# EAGLE design MCPGrundplatte_16_Ausgabe (EAGLE 9.6.2)
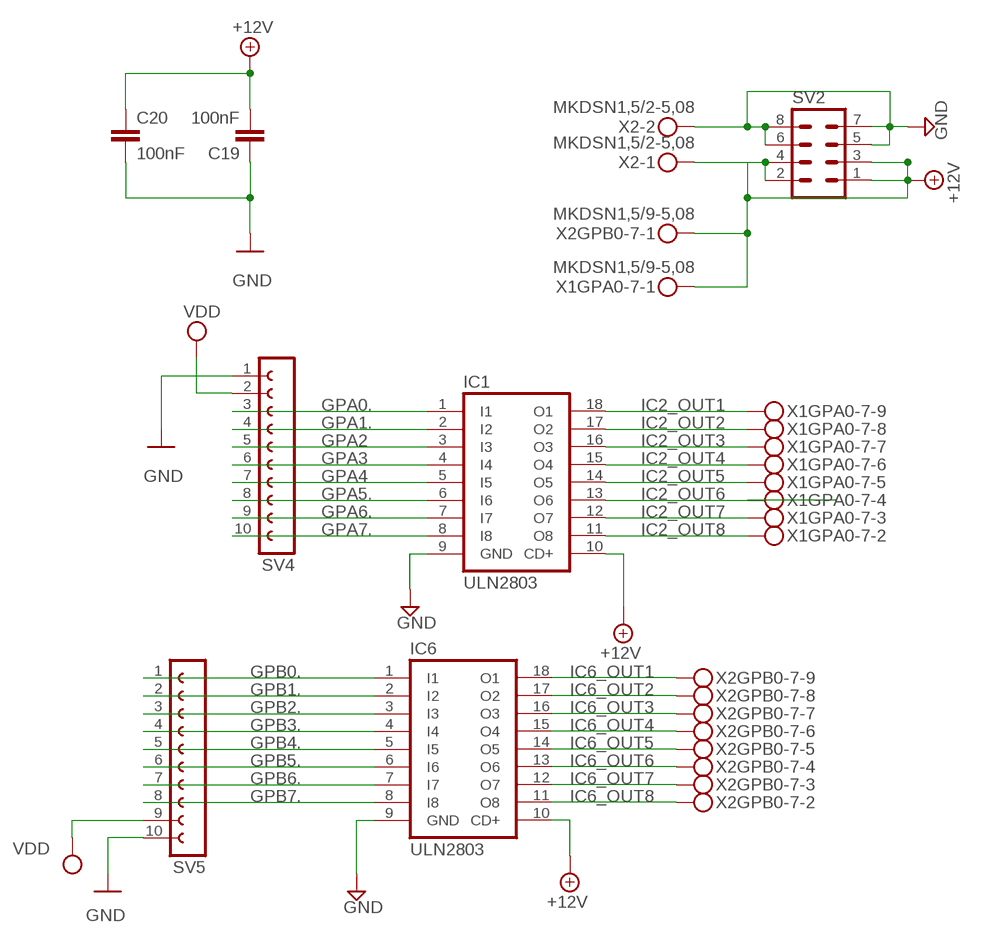
[diagram p0: schematic, sheet 1]

## Parts
C19  100nF  C-EU025-024X044  [C025-024X044]
C20  100nF  C-EU025-024X044  [C025-024X044]
IC1  ULN2803  ULN2803A  [DIL18]
IC6  ULN2803  ULN2803A  [DIL18]
SV2  MA04-2  [MA04-2]
SV4  FE10-1  [FE10]
SV5  FE10-1  [FE10]
X1GPA0-7  MKDSN1,5/9-5,08  [MKDSN1,5/9-5,08]
X2  MKDSN1,5/2-5,08  [MKDSN1,5/2-5,08]
X2GPB0-7  MKDSN1,5/9-5,08  [MKDSN1,5/9-5,08]

## Nets
+12V: C19.2 C20.1 IC1.10(CD+) IC6.10(CD+) SV2.1 SV2.2 SV2.3 SV2.4 X1GPA0-7.1 X2.1 X2GPB0-7.1
GND: C19.1 C20.2 IC1.9(GND) IC6.9(GND) SV2.5 SV2.6 SV2.7 SV2.8 SV4.1 SV5.10 X2.2
GPA0.: IC1.1(I1) SV4.3
GPA1.: IC1.2(I2) SV4.4
GPA2: IC1.3(I3) SV4.5
GPA3: IC1.4(I4) SV4.6
GPA4: IC1.5(I5) SV4.7
GPA5.: IC1.6(I6) SV4.8
GPA6.: IC1.7(I7) SV4.9
GPA7.: IC1.8(I8) SV4.10
GPB0.: IC6.1(I1) SV5.1
GPB1.: IC6.2(I2) SV5.2
GPB2.: IC6.3(I3) SV5.3
GPB3.: IC6.4(I4) SV5.4
GPB4.: IC6.5(I5) SV5.5
GPB5.: IC6.6(I6) SV5.6
GPB6.: IC6.7(I7) SV5.7
GPB7.: IC6.8(I8) SV5.8
IC2_OUT1: IC1.18(O1) X1GPA0-7.9
IC2_OUT2: IC1.17(O2) X1GPA0-7.8
IC2_OUT3: IC1.16(O3) X1GPA0-7.7
IC2_OUT4: IC1.15(O4) X1GPA0-7.6
IC2_OUT5: IC1.14(O5) X1GPA0-7.5
IC2_OUT6: IC1.13(O6) X1GPA0-7.4
IC2_OUT7: IC1.12(O7) X1GPA0-7.3
IC2_OUT8: IC1.11(O8) X1GPA0-7.2
IC6_OUT1: IC6.18(O1) X2GPB0-7.9
IC6_OUT2: IC6.17(O2) X2GPB0-7.8
IC6_OUT3: IC6.16(O3) X2GPB0-7.7
IC6_OUT4: IC6.15(O4) X2GPB0-7.6
IC6_OUT5: IC6.14(O5) X2GPB0-7.5
IC6_OUT6: IC6.13(O6) X2GPB0-7.4
IC6_OUT7: IC6.12(O7) X2GPB0-7.3
IC6_OUT8: IC6.11(O8) X2GPB0-7.2
VDD: SV4.2 SV5.9

## Library data of the parts
C19 C20 = rcl:C-EU: CAPACITOR, European symbol; SPICEPREFIX: C
IC1 IC6 = uln-udn:ULN2803A: DRIVER ARRAY
SV2 = con-lstb:MA04-2: PIN HEADER; OC_FARNELL: unknown; OC_NEWARK: unknown
SV4 SV5 = con-lsta:FE10-1: FEMALE HEADER; OC_FARNELL: unknown; OC_NEWARK: unknown
X1GPA0-7 X2GPB0-7 = con-phoenix-508:MKDSN1,5/9-5,08: MKDSN 1,5/ 9-5,08 Printklemme Nennstrom: 13,5 A Nennspannung: 250 V Rastermaß: 5,08 mm Polzahl: 9 Anschlussart: Schraubanschluss Montage: Löten Anschlussrichtung Leiter/Platine: 0 ° Artikelnummer: 1729199 Source: http://eshop.phoenixcontact.com .. 1729199.pdf
X2 = con-phoenix-508:MKDSN1,5/2-5,08: MKDSN 1,5/ 2-5,08 Printklemme Nennstrom: 13,5 A Nennspannung: 250 V Rastermaß: 5,08 mm Polzahl: 2 Anschlussart: Schraubanschluss Montage: Löten Anschlussrichtung Leiter/Platine: 0 ° Artikelnummer: 1729128 Source: http://eshop.phoenixcontact.com .. 1729128.pdf

## Board
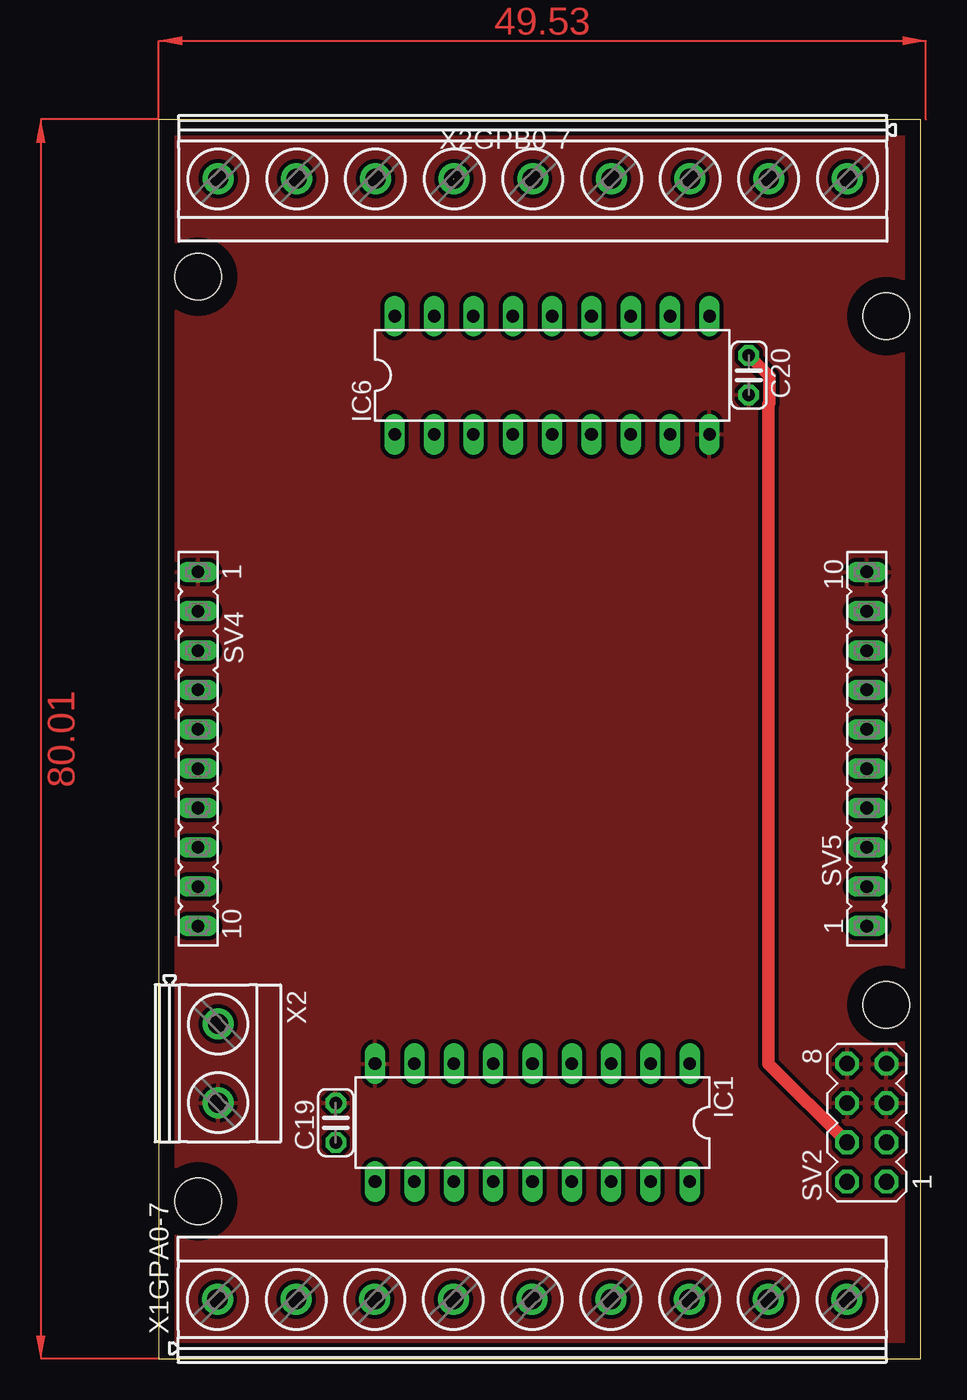
[diagram p1: board, top side]
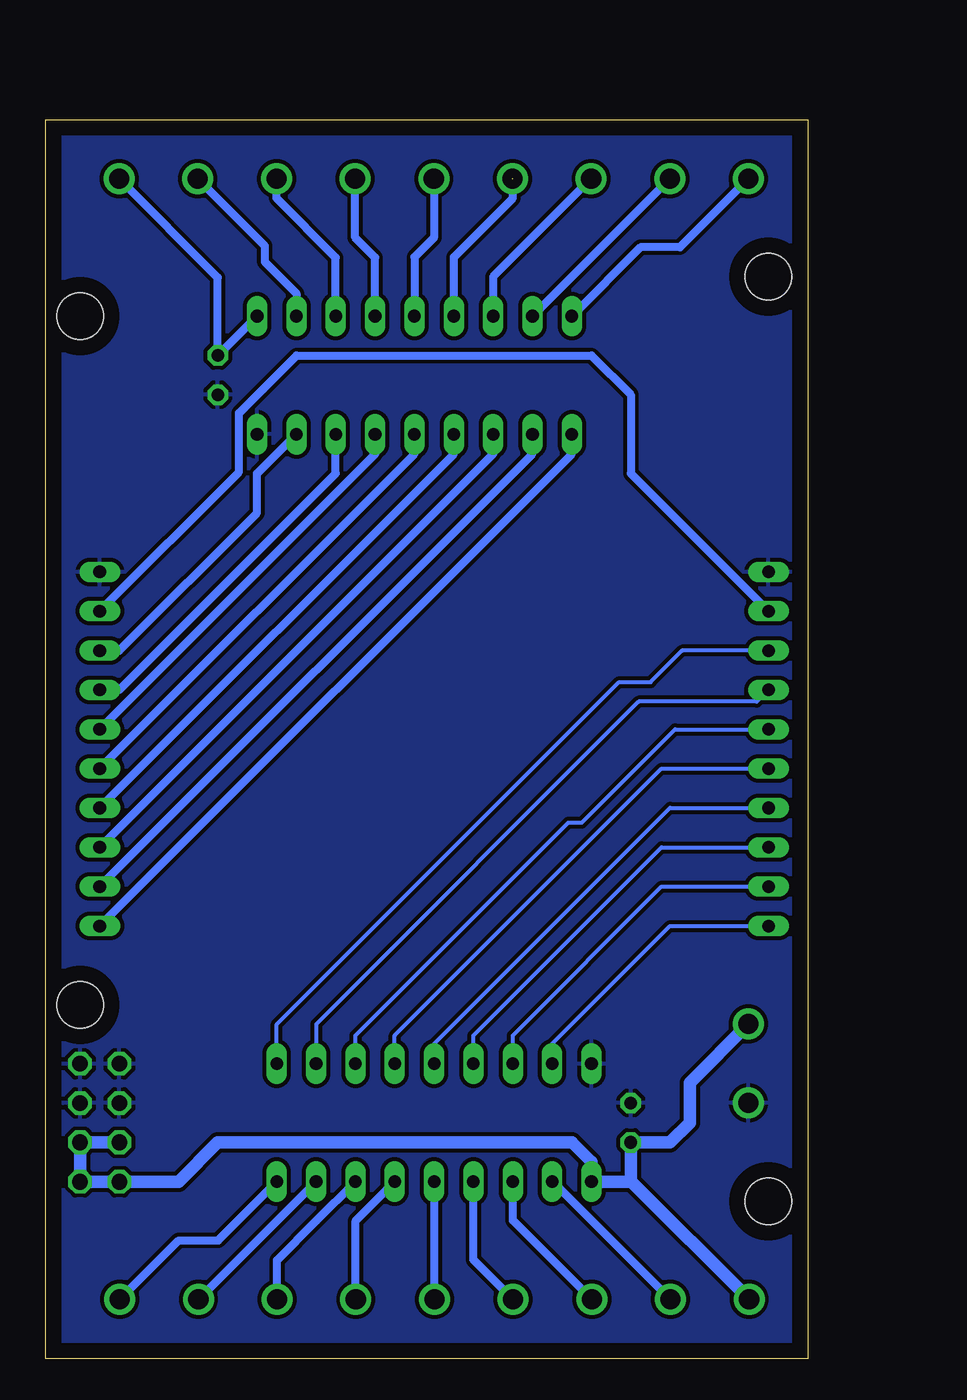
[diagram p2: board, bottom side, seen from below]

Size 49.2 x 80 mm. Coordinates in mm from the lower left corner, seen from the top.
Outline: 0,0 49.2,0 49.2,80 0,80 0,0
Copper layers (1*16): Top 0.035mm / dielectric 1.5mm / Bottom 0.035mm
Design rules "platinenbelichter": minimum track width 10mil, minimum drill 24mil, track to track 10mil, track to pad 10mil, pad to pad 10mil, via to via 10mil, smd to smd 10mil, copper to edge 40mil, drill to drill 8mil, minimum pad ring 10mil, minimum via ring 8mil, stop-mask expansion 10mil, vias tented up to drill 0mil, thermal gap 10mil
Holes 3 mm at 2.54,69.85 46.99,22.86 2.54,10.16 46.99,67.31

### Footprints (pad centres in the part's own frame; a part is rotated, then mirrored left to right if it is on the bottom)
C025-024X044 = drill 0.813 octagon: 1 -1.27,0; 2 1.27,0
DIL18 = drill 0.813 long: 1 -10.16,-3.81; 2 -7.62,-3.81; 3 -5.08,-3.81; 4 -2.54,-3.81; 5 0,-3.81; 6 2.54,-3.81; 7 5.08,-3.81; 8 7.62,-3.81; 9 10.16,-3.81; 10 10.16,3.81; 11 7.62,3.81; 12 5.08,3.81; 13 2.54,3.81; 14 0,3.81; 15 -2.54,3.81; 16 -5.08,3.81; 17 -7.62,3.81; 18 -10.16,3.81
MA04-2 = drill 1.016 octagon: 1 -3.81,-1.27; 2 -3.81,1.27; 3 -1.27,-1.27; 4 -1.27,1.27; 5 1.27,-1.27; 6 1.27,1.27; 7 3.81,-1.27; 8 3.81,1.27
FE10 = drill 0.813 long: 1 -11.43,0; 2 -8.89,0; 3 -6.35,0; 4 -3.81,0; 5 -1.27,0; 6 1.27,0; 7 3.81,0; 8 6.35,0; 9 8.89,0; 10 11.43,0
MKDSN1,5/9-5,08 = drill 1.3 pad 2: 1 -20.341,0.025; 2 -15.261,0.025; 3 -10.181,0.025; 4 -5.101,0.025; 5 -0.021,0.025; 6 5.059,0.025; 7 10.139,0.025; 8 15.219,0.025; 9 20.299,0.025
MKDSN1,5/2-5,08 = drill 1.3 pad 2: 1 -2.561,0.025; 2 2.519,0.025

### Placement (x,y rotation side)
C19  11.43,15.24 270 top
C20  38.1,63.5 270 top
IC1  24.13,15.24 180 top
IC6  25.4,63.5 0 top
SV2  45.72,15.24 90 top
SV4  2.54,39.37 270 top
SV5  45.72,39.37 90 top
X1GPA0-7  24.13,3.81 0 top
X2  3.81,19.05 270 top
X2GPB0-7  24.13,76.2 180 top

### Tracks (layer width: path | path; a pad name or v marks a point on that pad's centre or on a via)
+12V
  Top 0.813: SV2.4 39.37,19.05 39.37,61.63 39.42,61.68 39.42,63.45 C20.1
  Bottom 0.508: IC6.10 C20.1 38.1,69.8 X2GPB0-7.1
  Bottom 0.813: SV2.4 SV2.3 SV2.1 SV2.2 40.64,11.43 38.1,13.97 15.24,13.97 13.97,12.7 IC1.10 11.38,11.43 | X1GPA0-7.1 11.38,11.43 | 11.38,11.43 11.43,11.48 C19.2 8.89,13.97 7.62,15.24 7.62,17.83 X2.1
GND
  pour Bottom: 0,80.01 49.53,80.01 49.53,0 0,0
  pour Top: 0,80.01 49.53,80.01 49.53,0 0,0
GPA0.
  Bottom 0.254: IC1.1 34.29,21.59 12.19,43.69 10.16,43.69 8.13,45.72 SV4.3
GPA1.
  Bottom 0.254: IC1.2 31.75,21.59 10.92,42.42 3.3,42.42 SV4.4
GPA2
  Bottom 0.254: IC1.3 29.21,20.87 15.46,34.62 14.6,34.62 8.58,40.64 SV4.5
GPA3
  Bottom 0.254: IC1.4 26.67,20.87 9.44,38.1 SV4.6
GPA4
  Bottom 0.254: IC1.5 24.13,20.32 8.89,35.56 SV4.7
GPA5.
  Bottom 0.254: IC1.6 21.59,20.87 9.44,33.02 SV4.8
GPA6.
  Bottom 0.254: IC1.7 19.05,20.87 9.44,30.48 SV4.9
GPA7.
  Bottom 0.254: IC1.8 16.51,20.32 8.89,27.94 SV4.10
GPB0.
  Bottom 0.508: SV5.1 15.24,58.42 IC6.1
GPB1.
  Bottom 0.508: SV5.2 17.78,58.42 IC6.2
GPB2.
  Bottom 0.508: SV5.3 20.32,58.42 IC6.3
GPB3.
  Bottom 0.508: SV5.4 22.86,58.42 IC6.4
GPB4.
  Bottom 0.508: SV5.5 25.4,58.42 IC6.5
GPB5.
  Bottom 0.508: IC6.6 27.94,58.42 SV5.6
GPB6.
  Bottom 0.508: IC6.7 30.48,57.15 44.45,43.18 SV5.7
GPB7.
  Bottom 0.508: IC6.8 35.56,57.15 35.56,54.61 44.45,45.72 SV5.8
IC2_OUT1
  Bottom 0.508: X1GPA0-7.9 40.62,7.64 38.08,7.64 IC1.18
IC2_OUT2
  Bottom 0.508: X1GPA0-7.8 IC1.17
IC2_OUT3
  Bottom 0.508: X1GPA0-7.7 34.27,6.37 31.75,8.89 IC1.16
IC2_OUT4
  Bottom 0.508: X1GPA0-7.6 29.19,8.91 IC1.15
IC2_OUT5
  Bottom 0.508: X1GPA0-7.5 24.11,11.41 IC1.14
IC2_OUT6
  Bottom 0.508: X1GPA0-7.4 21.59,6.4 IC1.13
IC2_OUT7
  Bottom 0.508: X1GPA0-7.3 19.05,8.94 IC1.12
IC2_OUT8
  Bottom 0.508: X1GPA0-7.2 16.46,11.43 IC1.11
IC6_OUT1
  Bottom 0.508: IC6.18 10.79,71.75 8.26,71.75 X2GPB0-7.9
IC6_OUT2
  Bottom 0.508: X2GPB0-7.8 IC6.17
IC6_OUT3
  Bottom 0.508: X2GPB0-7.7 20.32,69.85 IC6.16
IC6_OUT4  (1 unrouted)
  Bottom 0.508: IC6.15 22.86,71.12 19.05,74.93 19.05,76.15
IC6_OUT5
  Bottom 0.508: IC6.14 25.4,71.12 24.15,72.37 X2GPB0-7.5
IC6_OUT6
  Bottom 0.508: X2GPB0-7.4 29.23,72.39 27.94,71.1 IC6.13
IC6_OUT7
  Bottom 0.508: X2GPB0-7.3 34.31,74.93 30.48,71.1 IC6.12
IC6_OUT8
  Bottom 0.508: X2GPB0-7.2 35.07,71.86 35.07,70.83 33.02,68.77 IC6.11
VDD
  Bottom 0.508: SV5.9 36.73,57.25 36.73,61.06 33.02,64.77 13.97,64.77 11.43,62.23 11.43,57.15 SV4.2
(copper drawn outside any net)
  shapes: Top area x2

### Text on the board
tDocu: SX2MCP23017 / 16 Output / Version V2